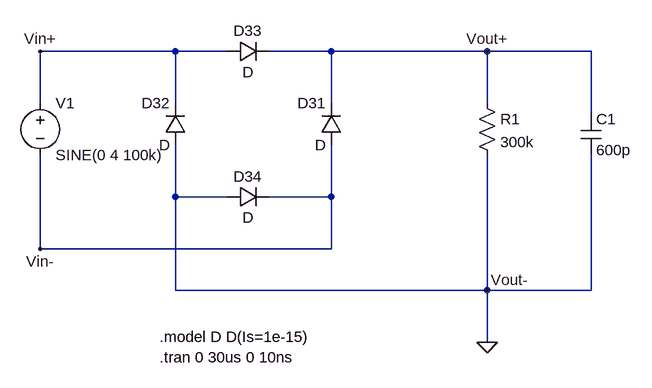
[diagram p0: schematic Draft2.asc]
Draft2.asc, the LTspice schematic file:
Version 4
SHEET 1 900 732
WIRE 192 256 -16 256
WIRE 272 256 192 256
WIRE 432 256 336 256
WIRE 672 256 432 256
WIRE 832 256 672 256
WIRE -16 336 -16 256
WIRE 192 336 192 256
WIRE 432 336 432 256
WIRE 672 336 672 256
WIRE 832 352 832 256
WIRE 192 480 192 400
WIRE 272 480 192 480
WIRE 432 480 432 400
WIRE 432 480 336 480
WIRE -16 560 -16 416
WIRE 432 560 432 480
WIRE 432 560 -16 560
WIRE 192 624 192 480
WIRE 672 624 672 416
WIRE 672 624 192 624
WIRE 832 624 832 416
WIRE 832 624 672 624
WIRE 672 704 672 624
FLAG -16 560 Vin-
FLAG -16 256 Vin+
FLAG 672 256 Vout+
FLAG 672 624 Vout-
FLAG 672 704 0
SYMBOL diode 448 400 R180
WINDOW 0 24 64 Left 2
WINDOW 3 24 0 Left 2
SYMATTR InstName D31
SYMBOL diode 208 400 R180
WINDOW 0 24 64 Left 2
WINDOW 3 24 0 Left 2
SYMATTR InstName D32
SYMBOL diode 272 272 R270
WINDOW 0 32 32 VTop 2
WINDOW 3 0 32 VBottom 2
SYMATTR InstName D33
SYMBOL diode 272 496 R270
WINDOW 0 32 32 VTop 2
WINDOW 3 0 32 VBottom 2
SYMATTR InstName D34
SYMBOL voltage -16 320 R0
SYMATTR InstName V1
SYMATTR Value SINE(0 4 100k)
SYMBOL res 656 320 R0
SYMATTR InstName R1
SYMATTR Value 300k
SYMBOL cap 816 352 R0
SYMATTR InstName C1
SYMATTR Value 600p
TEXT 168 696 Left 2 !.model D D(Is=1e-15)\n.tran 0 30us 0 10ns

The netlist it stands for:
* Draft2.asc
D31 Vin- Vout+ D
D32 0 Vin+ D
D33 Vin+ Vout+ D
D34 0 Vin- D
V1 Vin+ Vin- SINE(0 4 100k)
R1 Vout+ 0 300k
C1 Vout+ 0 600p
.model D D
.lib standard.dio
.model D D(Is=1e-15)
.tran 0 30us 0 10ns
.backanno
.end